# EAGLE design DamianGonzalez (EAGLE 9.6.2)
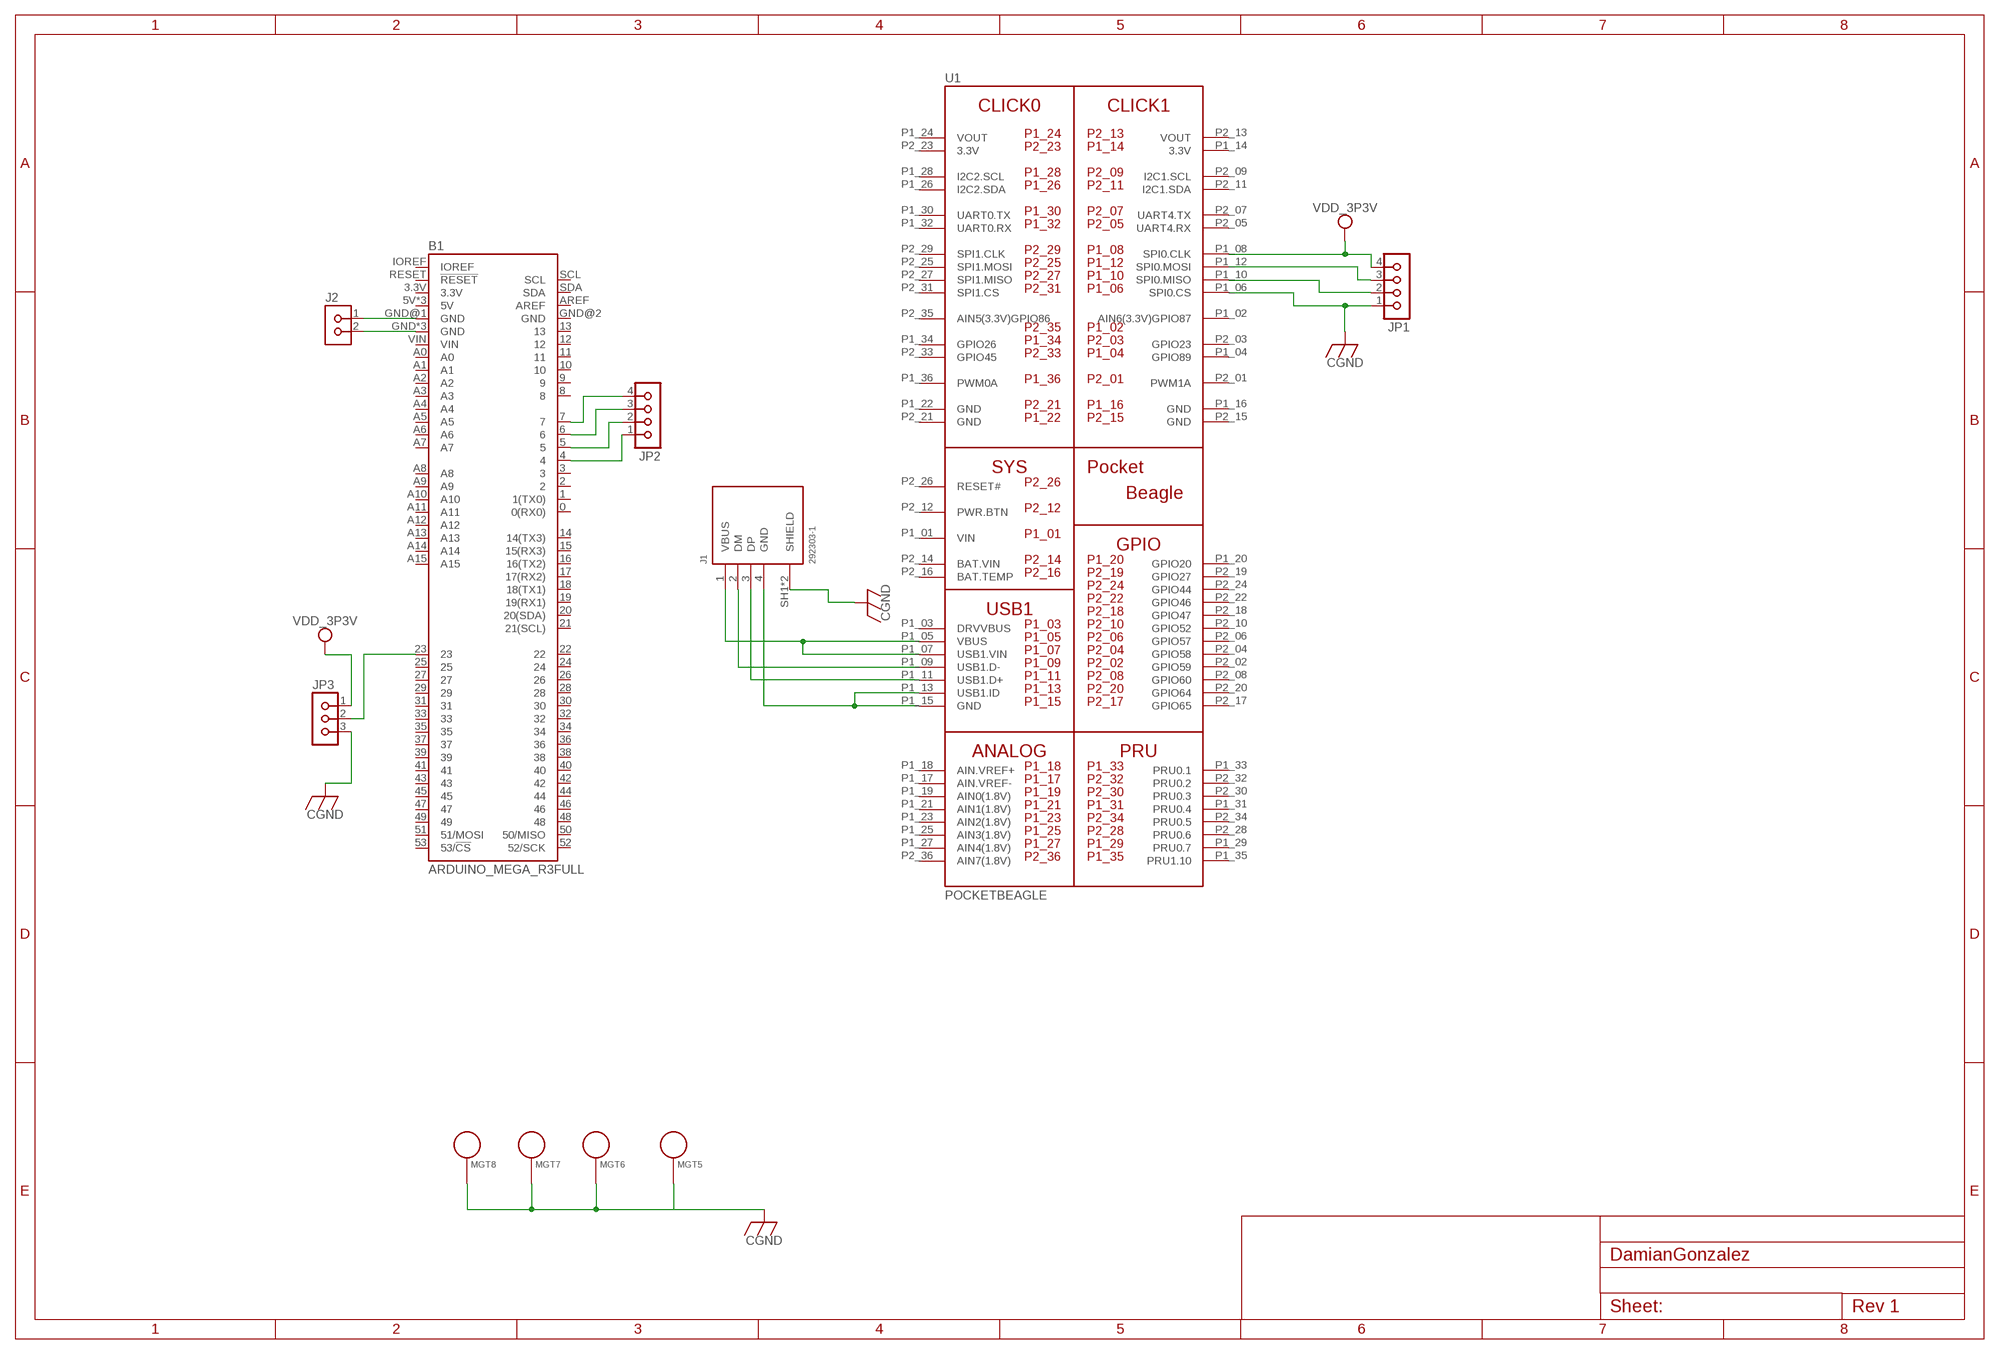
[diagram p0: schematic, sheet 1]

## Parts
B1  ARDUINO_MEGA_R3FULL  [ARDUINO_MEGA_NO_SILK]
J1  292303-1  [TE_292303-1]
J2  PINHD-1X2  [H1X2-2.54]
JP1  PINHD-1X4  [H1X4-2.54]
JP2  PINHD-1X4  [H1X4-2.54]
JP3  PINHD-1X3  [H1X3-2.54]
MGT5  MOUNTING_HOLE  [MOUNTING_HOLE]
MGT6  MOUNTING_HOLE  [MOUNTING_HOLE]
MGT7  MOUNTING_HOLE  [MOUNTING_HOLE]
MGT8  MOUNTING_HOLE  [MOUNTING_HOLE]
U1  POCKETBEAGLE  [POCKETBEAGLE]

## Nets
CGND: J1.SH1(SHIELD) J1.SH2(SHIELD) JP1.1 JP3.3 MGT5.P$1 MGT6.P$1 MGT7.P$1 MGT8.P$1 U1.P1_06(SPI0.CS)
N$1: J1.1(VBUS) U1.P1_05(VBUS) U1.P1_07(USB1.VIN)
N$2: J1.4(GND) U1.P1_13(USB1.ID) U1.P1_15(GND)
N$3: J1.3(DP) U1.P1_11(USB1.D+)
N$4: J1.2(DM) U1.P1_09(USB1.D-)
N$6: JP1.3 U1.P1_12(SPI0.MOSI)
N$7: JP1.2 U1.P1_10(SPI0.MISO)
N$9: B1.7 JP2.4
N$10: B1.6 JP2.3
N$11: B1.5 JP2.2
N$12: B1.4 JP2.1
N$13: B1.GND@1(GND) J2.1
N$14: B1.GND B1.GND@3(GND) B1.GND@4(GND) J2.2
N$15: B1.23 JP3.2
VDD_3P3V: JP1.4 JP3.1 U1.P1_08(SPI0.CLK)
Unconnected: B1.0(0(RX0)) B1.1(1(TX0)) B1.2 B1.3 B1.3.3V B1.5V B1.5V@1(5V) B1.5V@2(5V) B1.8 B1.9 B1.10 B1.11 B1.12 B1.13 B1.14(14(TX3)) B1.15(15(RX3)) B1.16(16(TX2)) B1.17(17(RX2)) B1.18(18(TX1)) B1.19(19(RX1)) B1.20(20(SDA)) B1.21(21(SCL)) B1.22 B1.24 B1.25 B1.26 B1.27 B1.28 B1.29 B1.30 B1.31 B1.32 B1.33 B1.34 B1.35 B1.36 B1.37 B1.38 B1.39 B1.40 B1.41 B1.42 B1.43 B1.44 B1.45 B1.46 B1.47 B1.48 B1.49 B1.50(50/MISO) B1.51(51/MOSI) B1.52(52/SCK) B1.53(53/!CS) B1.A0 B1.A1 B1.A2 B1.A3 B1.A4 B1.A5 B1.A6 B1.A7 B1.A8 B1.A9 B1.A10 B1.A11 B1.A12 B1.A13 B1.A14 B1.A15 B1.AREF B1.GND@2(GND) B1.IOREF B1.RESET(!RESET) B1.SCL B1.SDA B1.VIN U1.P1_02(AIN6(3.3V)GPIO87) U1.P1_03(DRVVBUS) U1.P1_04(GPIO89) U1.P1_17(AIN.VREF-) U1.P1_18(AIN.VREF+) U1.P1_19(AIN0(1.8V)) U1.P1_20(GPIO20) U1.P1_21(AIN1(1.8V)) U1.P1_23(AIN2(1.8V)) U1.P1_25(AIN3(1.8V)) U1.P1_26(I2C2.SDA) U1.P1_27(AIN4(1.8V)) U1.P1_28(I2C2.SCL) U1.P1_29(PRU0.7) U1.P1_30(UART0.TX) U1.P1_31(PRU0.4) U1.P1_32(UART0.RX) U1.P1_33(PRU0.1) U1.P1_34(GPIO26) U1.P1_35(PRU1.10) U1.P1_36(PWM0A) U1.P2_01(PWM1A) U1.P2_02(GPIO59) U1.P2_03(GPIO23) U1.P2_04(GPIO58) U1.P2_05(UART4.RX) U1.P2_06(GPIO57) U1.P2_07(UART4.TX) U1.P2_08(GPIO60) U1.P2_09(I2C1.SCL) U1.P2_10(GPIO52) U1.P2_11(I2C1.SDA) U1.P2_12(PWR.BTN) U1.P2_16(BAT.TEMP) U1.P2_17(GPIO65) U1.P2_18(GPIO47) U1.P2_19(GPIO27) U1.P2_20(GPIO64) U1.P2_22(GPIO46) U1.P2_24(GPIO44) U1.P2_25(SPI1.MOSI) U1.P2_26(RESET#) U1.P2_27(SPI1.MISO) U1.P2_28(PRU0.6) U1.P2_29(SPI1.CLK) U1.P2_30(PRU0.3) U1.P2_31(SPI1.CS) U1.P2_32(PRU0.2) U1.P2_33(GPIO45) U1.P2_34(PRU0.5) U1.P2_35(AIN5(3.3V)GPIO86) U1.P2_36(AIN7(1.8V))

## Power pins joined to a net without a drawn wire
3.3V: U1.P1_14(3.3V) U1.P2_23(3.3V)
BAT.VIN: U1.P2_14(BAT.VIN)
GND: U1.P1_16(GND) U1.P1_22(GND) U1.P2_15(GND) U1.P2_21(GND)
VIN: U1.P1_01(VIN)
VOUT: U1.P1_24(VOUT) U1.P2_13(VOUT)

## Library data of the parts
B1 = DamianGonzalez:ARDUINO_MEGA_R3: Arduino Mega R3 ATmega2560 R3 compatible footprint. SparkFun Products: Arduino Mega 2560 R3 <https://www.sparkfun.com/products/11061>
J1 = combo_lock:292303-1: CONN USB RECEPT R/A TYPE A 4POS Check prices <https://pricing.snapeda.com/parts/292303-1/TE%20Connectivity/view-part?ref=eda>; AVAILABILITY: In Stock; COMMENT: 292303-1; DESCRIPTION: Conn; Data; USB; Recept; 2.0; 4 Pos; 1 Port; Rt Angle; A Ser; Tin over Copper; MF: TE Connectivity; MP: 292303-1; PACKAGE: None; PRICE: None; PURCHASE-URL: https://pricing.snapeda.com/search/part/292303-1/?ref=eda
J2 = DamianGonzalez:PINHD-1X2: 2-pin 100 mil header
JP1 JP2 = DamianGonzalez:PINHD-1X4: PIN HEADER
JP3 = DamianGonzalez:PINHD-1X3: PIN HEADER
MGT5-MGT8 = combo_lock:MOUNTING_HOLE: Chassis Mounting Hole w/GND connection ability
U1 = combo_lock:POCKETBEAGLE

## Board
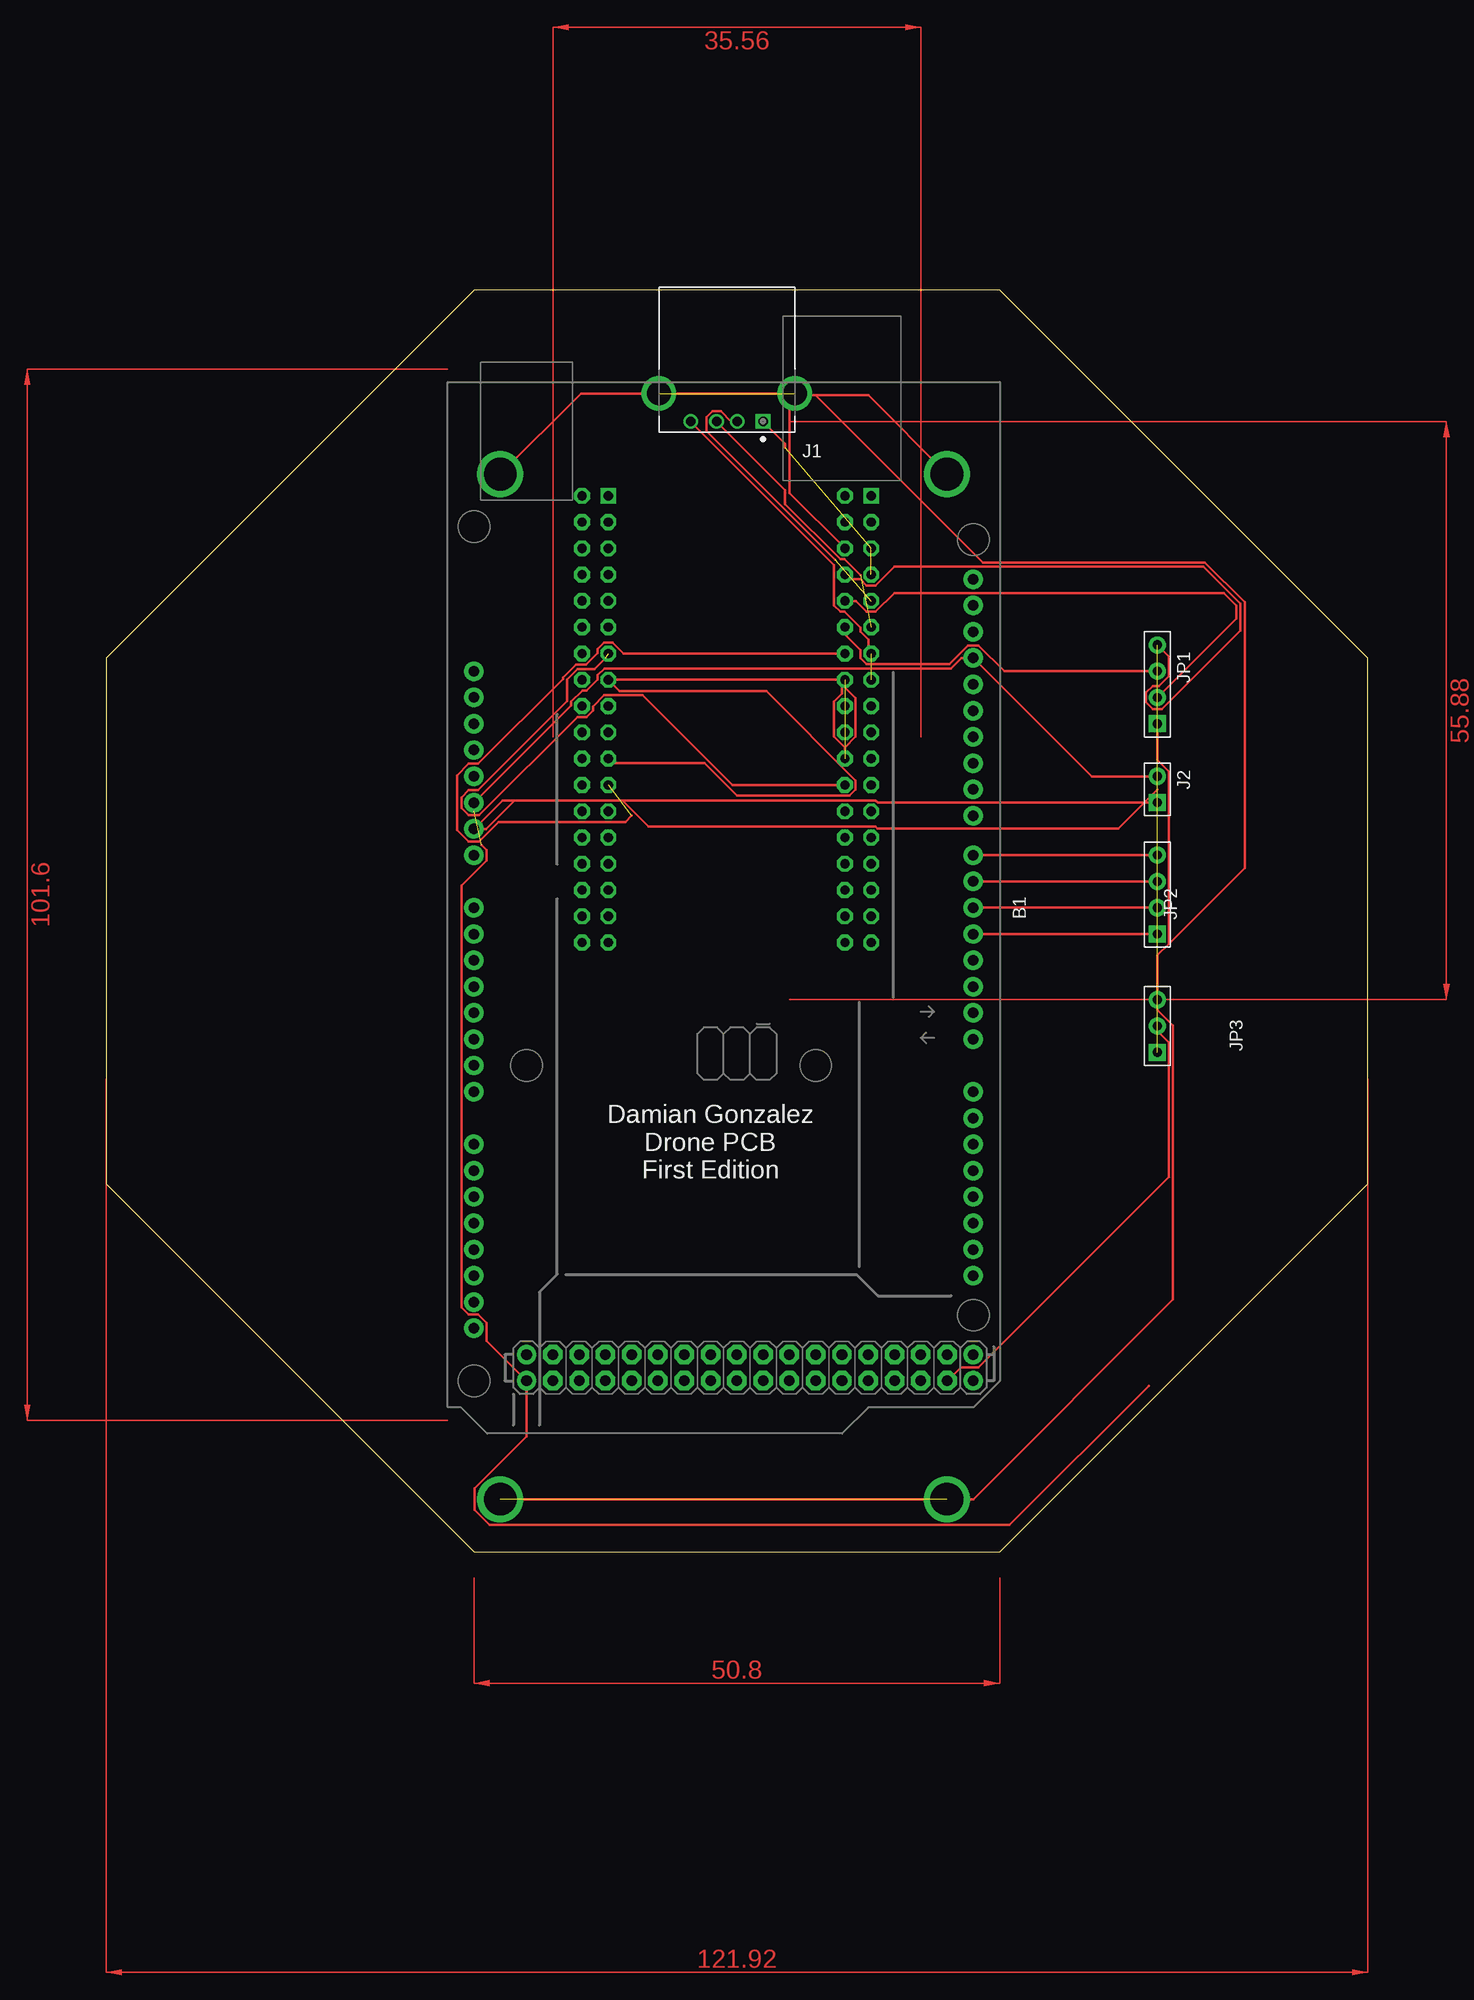
[diagram p1: board, top side]
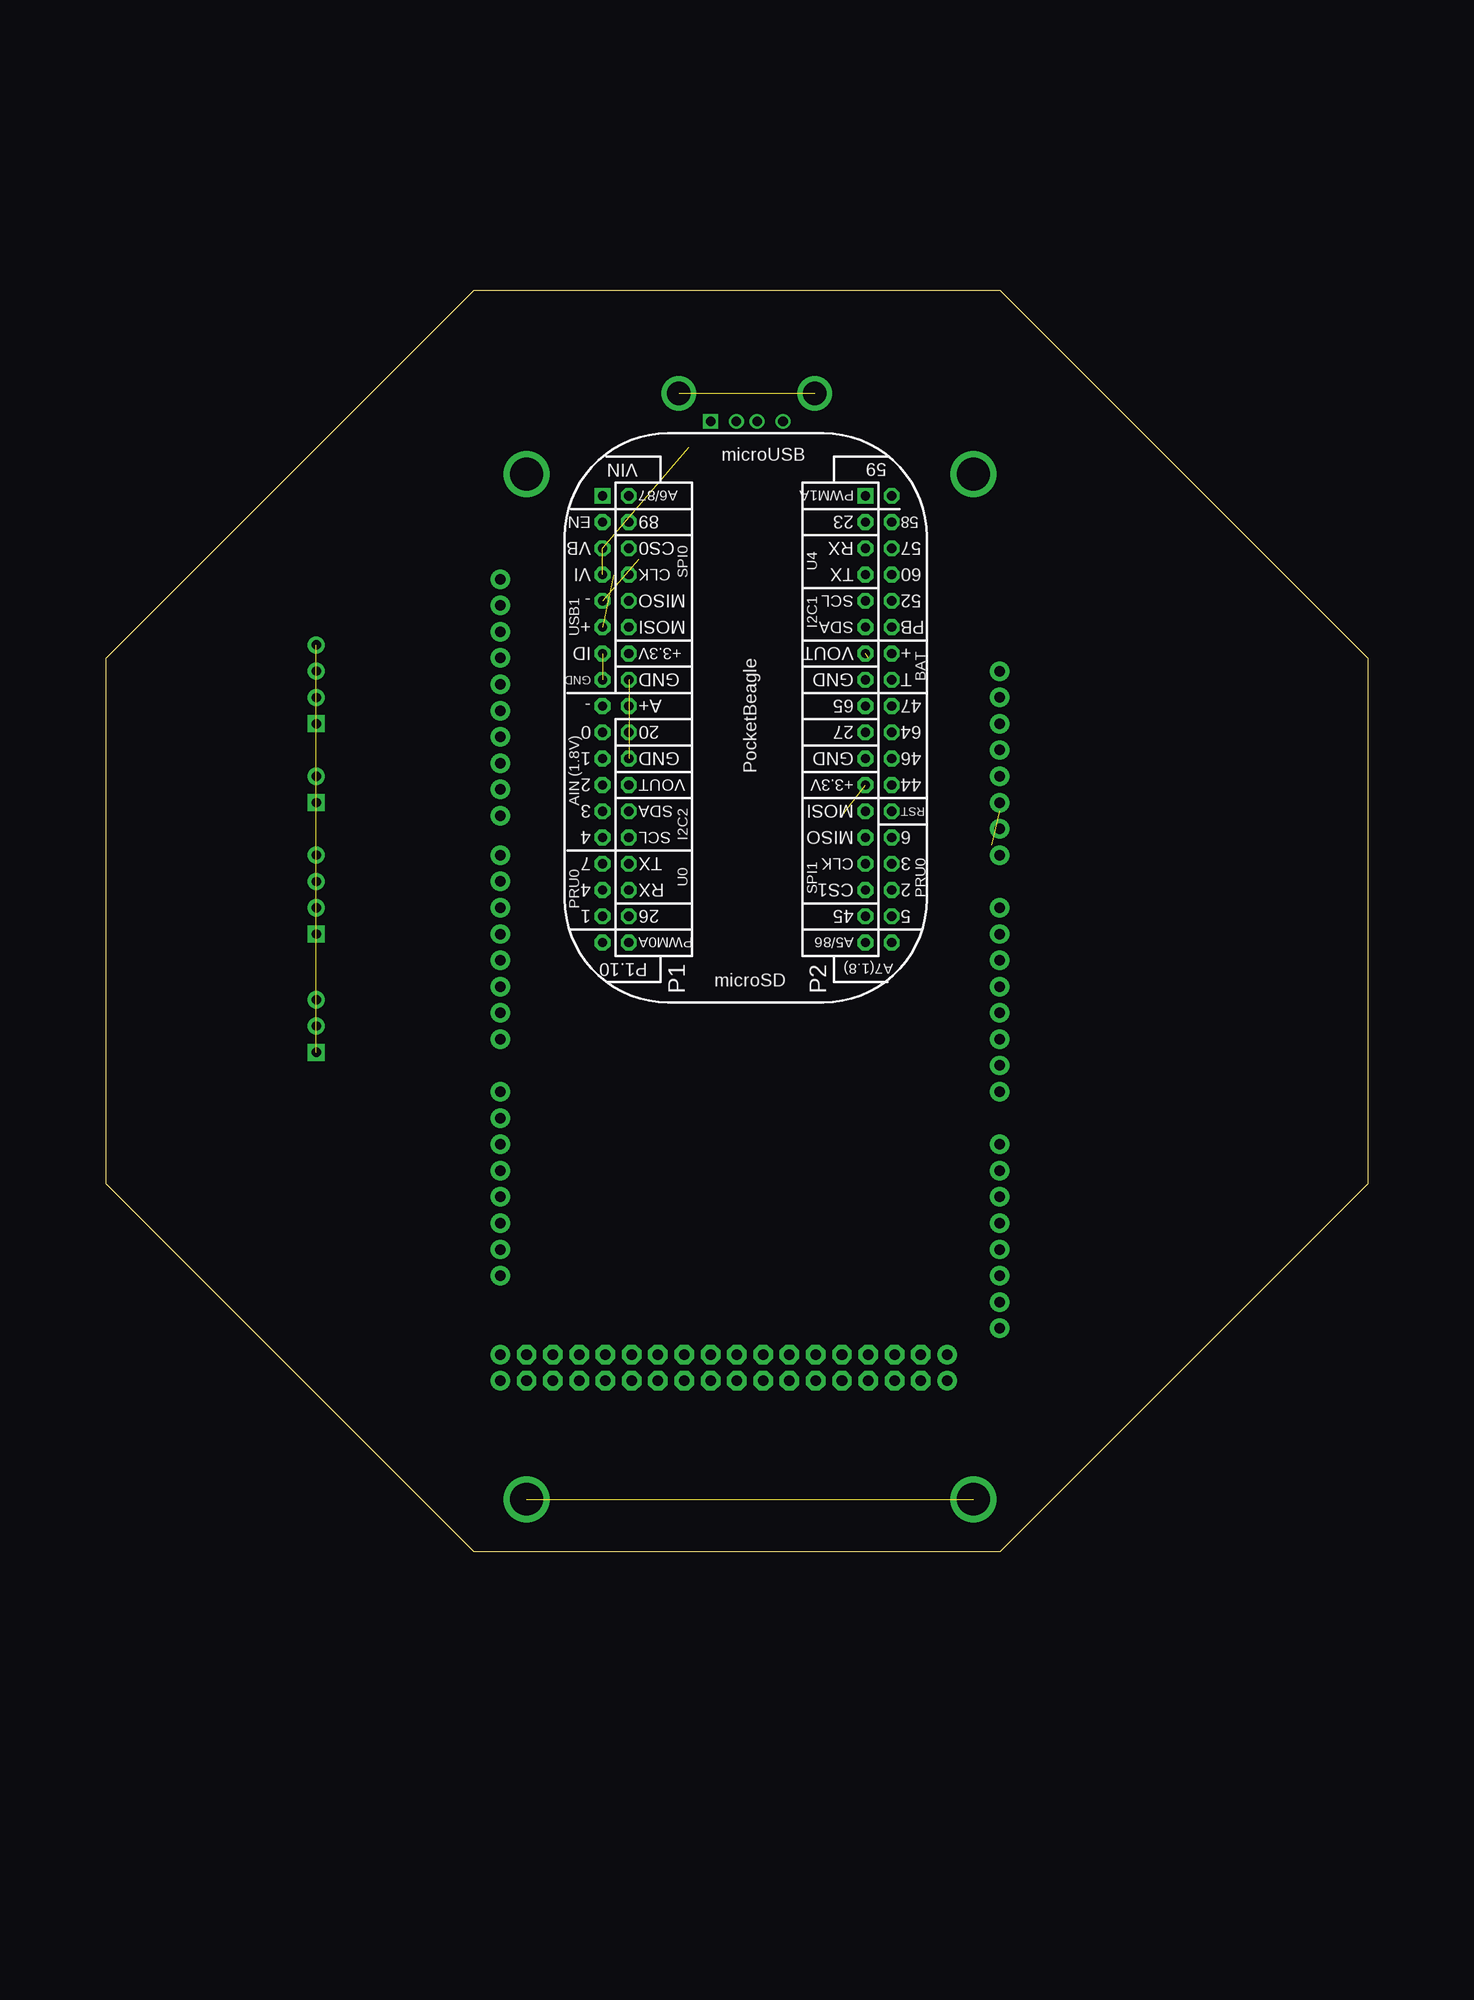
[diagram p2: board, bottom side, seen from below]

Size 121.92 x 121.92 mm. Coordinates in mm from the lower left corner, seen from the top.
Outline: 35.56,0 86.36,0 121.92,35.56 121.92,86.36 86.36,121.92 35.56,121.92 0,86.36 0,35.56 35.56,0
Copper layers (1*16): Top 0.035mm / dielectric 1.5mm / Bottom 0.035mm
Design rules "default": minimum track width 6mil, minimum drill 0.35mm, track to track 6mil, track to pad 6mil, pad to pad 6mil, via to via 6mil, smd to smd 6mil, copper to edge 40mil, drill to drill 6mil, minimum pad ring 10mil, minimum via ring 8mil, stop-mask expansion 4mil, vias tented up to drill 0mil, thermal gap 10mil

### Footprints (pad centres in the part's own frame; a part is rotated, then mirrored left to right if it is on the bottom)
ARDUINO_MEGA_NO_SILK = drill 1.016 pad 1.88: 0 13.97,24.13; 1 11.43,24.13; 2 8.89,24.13; 3 6.35,24.13; 3.3V -13.97,-24.13; 4 3.81,24.13; 5 1.27,24.13; 5V -11.43,-24.13; 5V@1 44.45,24.13; 5V@2 46.99,24.13; 6 -1.27,24.13; 7 -3.81,24.13; 8 -7.62,24.13; 9 -10.16,24.13; 10 -12.7,24.13; 11 -15.24,24.13; 12 -17.78,24.13; 13 -20.32,24.13; 14 19.05,24.13; 15 21.59,24.13; 16 24.13,24.13; 17 26.67,24.13; 18 29.21,24.13; 19 31.75,24.13; 20 34.29,24.13; 21 36.83,24.13; A0 1.27,-24.13; A1 3.81,-24.13; A2 6.35,-24.13; A3 8.89,-24.13; A4 11.43,-24.13; A5 13.97,-24.13; A6 16.51,-24.13; A7 19.05,-24.13; A8 24.13,-24.13; A9 26.67,-24.13; A10 29.21,-24.13; A11 31.75,-24.13; A12 34.29,-24.13; A13 36.83,-24.13; A14 39.37,-24.13; A15 41.91,-24.13; AREF -25.4,24.13; GND -8.89,-24.13; GND@1 -6.35,-24.13; GND@2 44.45,-19.05; GND@3 46.99,-19.05; GND@4 -22.86,24.13; IOREF -19.05,-24.13; NC -21.59,-24.13; RESET -16.51,-24.13; SCL -30.48,24.13; SDA -27.94,24.13; VIN -3.81,-24.13 | drill 1.016 pad 1.88 octagon: 22 44.45,21.59; 23 46.99,21.59; 24 44.45,19.05; 25 46.99,19.05; 26 44.45,16.51; 27 46.99,16.51; 28 44.45,13.97; 29 46.99,13.97; 30 44.45,11.43; 31 46.99,11.43; 32 44.45,8.89; 33 46.99,8.89; 34 44.45,6.35; 35 46.99,6.35; 36 44.45,3.81; 37 46.99,3.81; 38 44.45,1.27; 39 46.99,1.27; 40 44.45,-1.27; 41 46.99,-1.27; 42 44.45,-3.81; 43 46.99,-3.81; 44 44.45,-6.35; 45 46.99,-6.35; 46 44.45,-8.89; 47 46.99,-8.89; 48 44.45,-11.43; 49 46.99,-11.43; 50 44.45,-13.97; 51 46.99,-13.97; 52 44.45,-16.51; 53 46.99,-16.51
TE_292303-1 = drill 0.92 square: 1 0,0 | drill 0.92: 2 2.5,0; 3 4.5,0; 4 7,0 | drill 2.3: SH1 -3.07,-2.71; SH2 10.07,-2.71
H1X2-2.54 = drill 0.889 pad 1.651 square: 1 0,1.27 | drill 0.889 pad 1.651: 2 0,-1.27
H1X4-2.54 = drill 0.889 pad 1.651 square: 1 0,3.81 | drill 0.889 pad 1.651: 2 0,1.27; 3 0,-1.27; 4 0,-3.81
H1X3-2.54 = drill 0.889 pad 1.651 square: 1 0,2.54 | drill 0.889 pad 1.651: 2 0,0; 3 0,-2.54
MOUNTING_HOLE = drill 3.175 pad 4.445: P$1 0,0
POCKETBEAGLE = drill 0.889 pad 1.524 square: P1_01 5.91,3.53; P2_01 5.91,28.93 | drill 0.889 pad 1.524 octagon: P1_02 5.91,6.07; P1_03 8.45,3.53; P1_04 8.45,6.07; P1_05 10.99,3.53; P1_06 10.99,6.07; P1_07 13.53,3.53; P1_08 13.53,6.07; P1_09 16.07,3.53; P1_10 16.07,6.07; P1_11 18.61,3.53; P1_12 18.61,6.07; P1_13 21.15,3.53; P1_14 21.15,6.07; P1_15 23.69,3.53; P1_16 23.69,6.07; P1_17 26.23,3.53; P1_18 26.23,6.07; P1_19 28.77,3.53; P1_20 28.77,6.07; P1_21 31.31,3.53; P1_22 31.31,6.07; P1_23 33.85,3.53; P1_24 33.85,6.07; P1_25 36.39,3.53; P1_26 36.39,6.07; P1_27 38.93,3.53; P1_28 38.93,6.07; P1_29 41.47,3.53; P1_30 41.47,6.07; P1_31 44.01,3.53; P1_32 44.01,6.07; P1_33 46.55,3.53; P1_34 46.55,6.07; P1_35 49.09,3.53; P1_36 49.09,6.07; P2_02 5.91,31.47; P2_03 8.45,28.93; P2_04 8.45,31.47; P2_05 10.99,28.93; P2_06 10.99,31.47; P2_07 13.53,28.93; P2_08 13.53,31.47; P2_09 16.07,28.93; P2_10 16.07,31.47; P2_11 18.61,28.93; P2_12 18.61,31.47; P2_13 21.15,28.93; P2_14 21.15,31.47; P2_15 23.69,28.93; P2_16 23.69,31.47; P2_17 26.23,28.93; P2_18 26.23,31.47; P2_19 28.77,28.93; P2_20 28.77,31.47; P2_21 31.31,28.93; P2_22 31.31,31.47; P2_23 33.85,28.93; P2_24 33.85,31.47; P2_25 36.39,28.93; P2_26 36.39,31.47; P2_27 38.93,28.93; P2_28 38.93,31.47; P2_29 41.47,28.93; P2_30 41.47,31.47; P2_31 44.01,28.93; P2_32 44.01,31.47; P2_33 46.55,28.93; P2_34 46.55,31.47; P2_35 49.09,28.93; P2_36 49.09,31.47

### Placement (x,y rotation side)
B1  59.69,63.5 270 top
J1  63.5,109.22 180 top
J2  101.6,73.66 180 top
JP1  101.6,83.82 180 top
JP2  101.6,63.5 180 top
JP3  101.6,50.8 180 top
MGT5  81.28,5.08 0 top
MGT6  81.28,104.14 0 top
MGT7  38.1,104.14 0 top
MGT8  38.1,5.08 0 top
U1  77.47,107.95 270 bottom

### Tracks (layer width: path | path; a pad name or v marks a point on that pad's centre or on a via)
3.3V  (1 unrouted)
  Top 0.254: U1.P1_14 50.01,86.8 48.97,87.84 48.11,87.84 47.5,87.23 47.5,86.83 46.38,85.71 45.4,85.71 44.15,84.45 44.15,84.33 35.96,76.15 35.05,76.15 33.93,75.03 33.93,69.75 35.05,68.63 36.07,68.63 37.95,70.52 50.2,70.52 50.8,71.12
CGND  (2 unrouted)
  Top 0.254: JP1.1 101.6,76.49 102.7,75.39 102.7,58.75 | 68.58,111.76 84.73,95.61 106.2,95.61 110.03,91.78 110.03,66.08 102.7,58.75 | 102.7,58.75 101.6,57.64 JP3.3 101.6,52.36 103.11,50.85 103.11,24.37 83.82,5.08 MGT8.P$1 | 68.58,111.76 66.04,111.76 | 66.04,111.76 66.04,102.32 U1.P1_06 | MGT6.P$1 73.66,111.76 68.58,111.76 | 66.04,111.76 65.87,111.93 J1.SH2 45.89,111.93 MGT7.P$1
GND  (1 unrouted)
  Top 0.254: 71.4,77.71 70.36,78.75 70.36,82.15 71.12,82.91 71.12,83.82 72.44,82.5 72.44,78.75 71.4,77.71 | 71.4,77.71 U1.P1_22 | U1.P1_16 U1.P2_15 49.63,83.17 63.81,83.17 72.44,74.53 72.44,73.67 71.83,73.06 60.99,73.06 57.84,76.2 48.26,76.2 48.26,76.36 U1.P2_21
N$1  (2 unrouted)
  Top 0.254: J1.1 65.63,107.09 65.63,106.68
N$2  (1 unrouted)
  Top 0.254: J1.4 70.36,95.36 70.36,91.45 70.97,90.84 71.37,90.84 72.9,89.31 72.9,88.91 73.66,88.15 73.66,86.36 73.94,86.64 U1.P1_13
N$3  (1 unrouted)
  Top 0.254: J1.3 65.63,102.59 65.63,101.25 70.97,95.92 71.37,95.92 72.9,94.39
N$4  (1 unrouted)
  Top 0.254: 70.46,95.86 58.01,108.31 58.01,109.63 58.59,110.21 59.41,110.21 60.41,109.22 J1.2
N$6
  Top 0.254: JP1.3 86.81,85.09 84.33,87.58 83.31,87.58 81.49,85.76 73.51,85.76 72.9,86.37 72.9,87.12 71.12,88.9 71.12,89.06 U1.P1_12
N$7
  Top 0.254: JP1.2 109.22,90.17 109.22,91.44 108,92.66 76.19,92.66 74.37,90.84 73.51,90.84 72.47,91.88 U1.P1_10
N$9
  Top 0.254: JP2.4 B1.7
N$10
  Top 0.254: JP2.3 B1.6
N$11
  Top 0.254: JP2.2 B1.5
N$12
  Top 0.254: JP2.1 B1.4
N$13
  Top 0.254: J2.1 74.58,72.39 74.37,72.6 38.31,72.6 B1.GND@1 36.71,69.85 39.46,72.6 49.89,72.6 52.43,70.06 74.37,70.06 74.53,69.9 97.84,69.9 101.6,73.66
N$14  (1 unrouted)
  Top 0.254: J2.2 95.25,74.93 B1.GND@4 82.67,86.36 81.66,85.35 48.16,85.35 47.5,84.69 47.5,84.29 46.43,83.22 46.03,83.22 44.96,82.15 44.96,81.79 B1.GND 35.56,71.58 | 100.79,16.05 87.32,2.58 37.06,2.58 35.6,4.04 35.6,6.12 40.64,11.16 B1.GND@3 36.78,20.37 36.78,22.09 35.96,22.91 35.05,22.91 34.34,23.62 34.34,64.37 36.78,66.81 36.78,67.81 36.3,68.29
N$15
  Top 0.152: JP3.2 101.6,50.23 | B1.23 82.65,17.88 84.3,17.88
  Top 0.254: JP3.2 101.6,50.31 102.7,49.2 102.7,36.21 84.33,17.83 82.6,17.83 B1.23
VDD_3P3V  (1 unrouted)
  Top 0.254: JP1.4 102.7,86.53 102.7,84.63 101.73,83.66 101.14,83.66 100.5,83.01 100.5,82.09 101.14,81.44 102.06,81.44 109.63,89.01 109.63,91.61 106.04,95.2 76.19,95.2 74.37,93.38 73.51,93.38 72.91,93.98 71.12,93.98 71.12,94.14 U1.P1_08
VOUT  (1 unrouted)
  Top 0.254: U1.P1_24 60.52,74.1 51.86,82.76 48.11,82.76 47.04,81.69 47.04,81.29 46.43,80.68 45.57,80.68 36.07,71.17 35.05,71.17 34.34,71.89 34.34,72.89 35.05,73.61 35.96,73.61 44.55,82.2 44.55,84.28 45.57,85.3 47.2,85.3 48.26,86.36
(copper drawn outside any net)
  shapes: Top area x5

### Text on the board
tPlace: Damian Gonzalez / Drone PCB / First Edition